# Altium schematic sheet UARC_Sensor.SchDoc
size A2; SheetNumber: 1; SheetTotal: 1
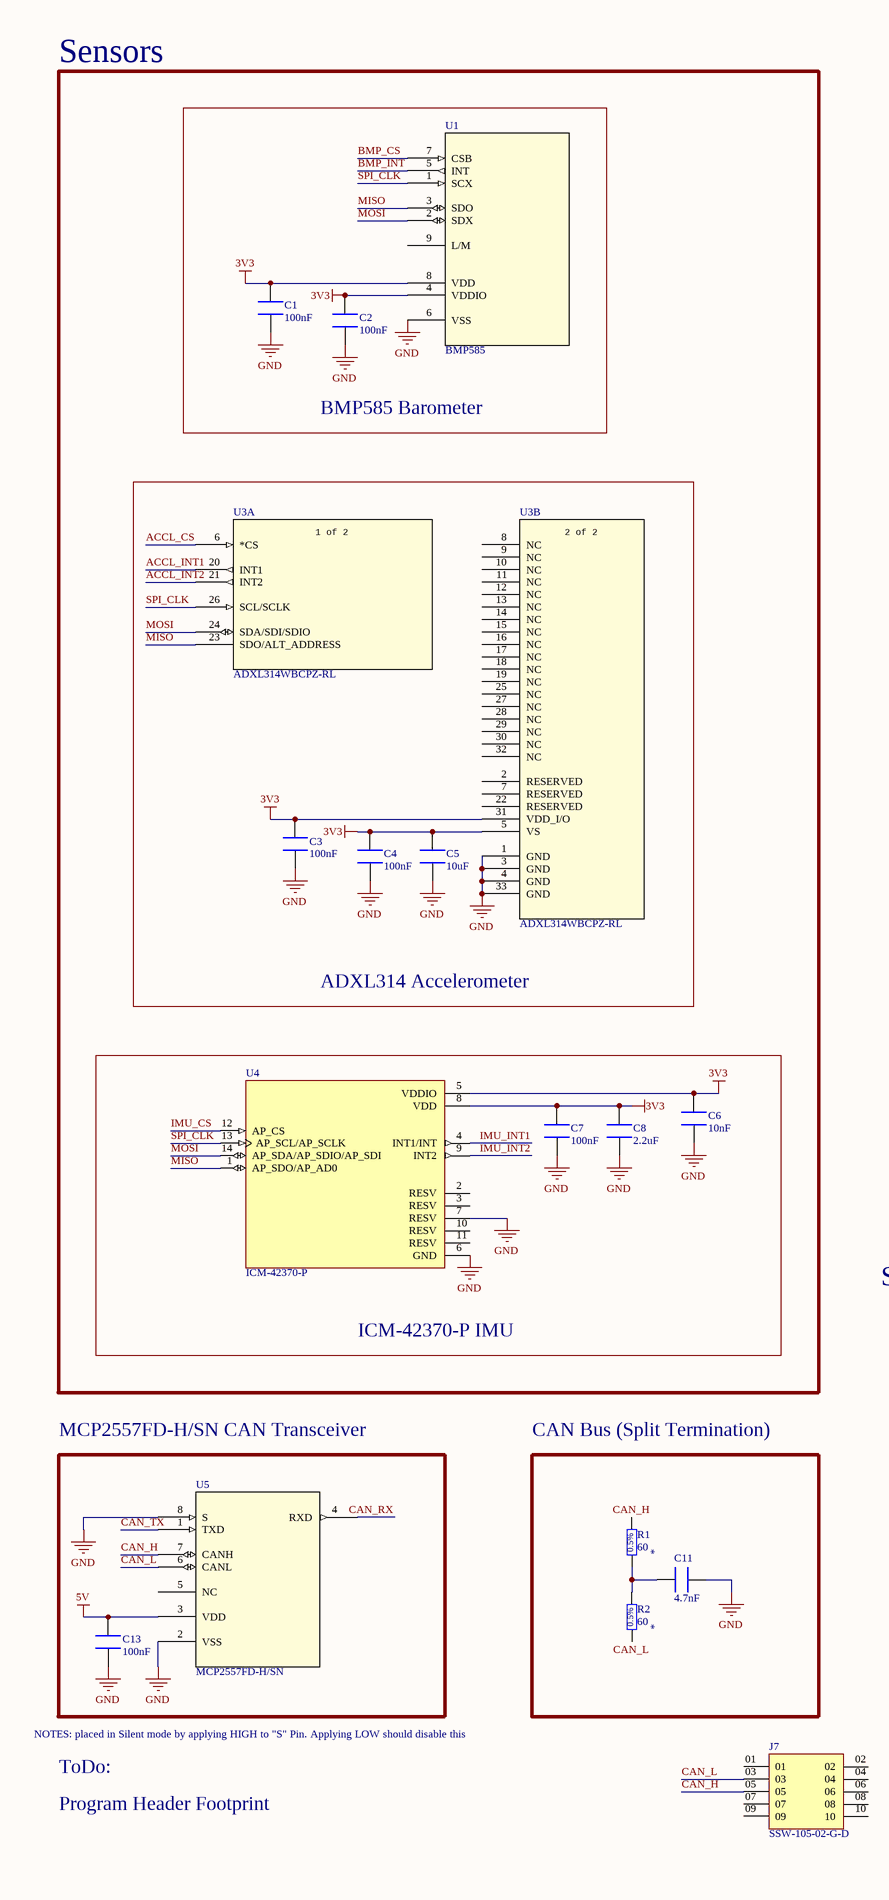
[diagram p0: UARC_Sensor.SchDoc, left]
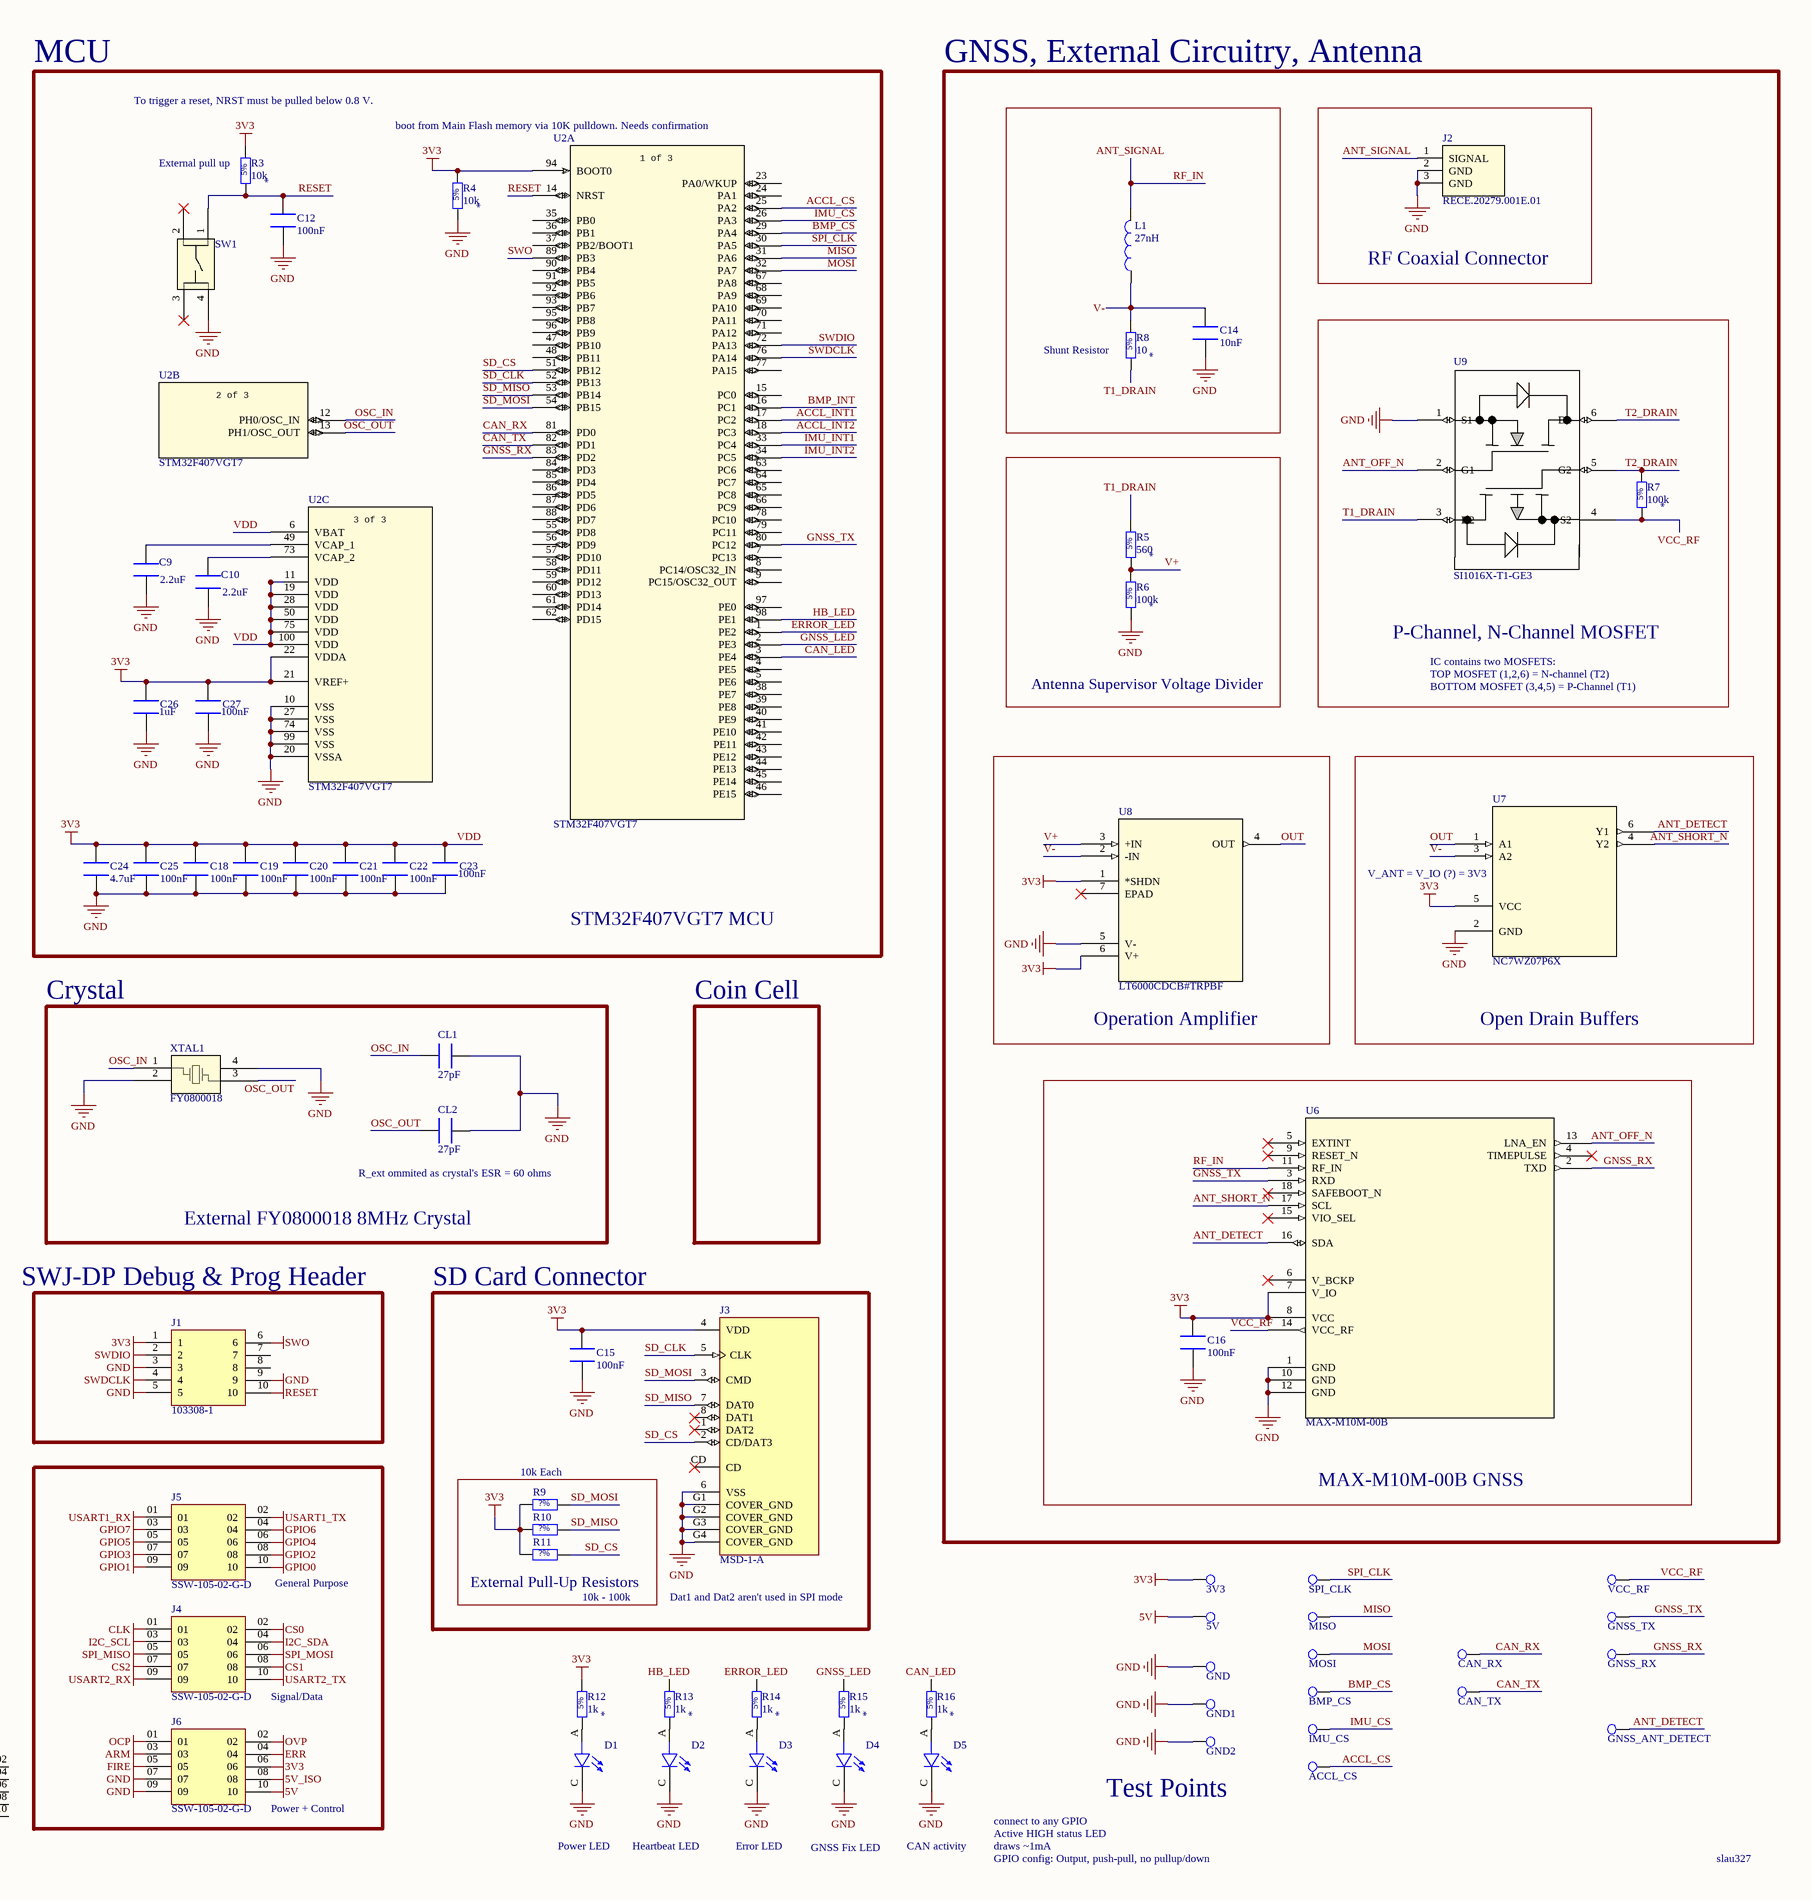
[diagram p1: UARC_Sensor.SchDoc, right]

## Parts
3V3  Test Point  [Test Point Pad Large]  (value not drawn)  (no BOM)
5V  Test Point  [Test Point Pad Large]  (value not drawn)  (no BOM)
ACCL_CS  Test Point  [Test Point Pad Large]  (value not drawn)  (no BOM)
BMP_CS  Test Point  [Test Point Pad Large]  (value not drawn)  (no BOM)
C1  100nF  [CAPACITOR_0805_2012M-70N]
C2  100nF  [CAPACITOR_0805_2012M-70N]
C3  100nF  [CAPACITOR_0805_2012M-70N]
C4  100nF  [CAPACITOR_0805_2012M-70N]
C5  10uF  [CAPACITOR_0805_2012M-70N]
C6  10nF  [CAPACITOR_0805_2012M-70N]
C7  100nF  [CAPACITOR_0805_2012M-70N]
C8  2.2uF  [CAPACITOR_0805_2012M-70N]
C9  2.2uF  [CAPACITOR_0805_2012M-70N]
C10  2.2uF  [CAPACITOR_0805_2012M-70N]
C11  4.7nF  [CAPACITOR_0805_2012M-70N]
C12  100nF  [CAPACITOR_0805_2012M-70N]
C13  100nF  [CAPACITOR_0805_2012M-70N]
C14  10nF  [CAPACITOR_0402_1005M_55N]
C15  100nF  [CAPACITOR_0805_2012M-70N]
C16  100nF  [CAPACITOR_0805_2012M-70N]
C18  100nF  [CAPACITOR_0805_2012M-70N]
C19  100nF  [CAPACITOR_0805_2012M-70N]
C20  100nF  [CAPACITOR_0805_2012M-70N]
C21  100nF  [CAPACITOR_0805_2012M-70N]
C22  100nF  [CAPACITOR_0805_2012M-70N]
C23  100nF  [CAPACITOR_0805_2012M-70N]
C24  4.7uF  [CAPACITOR_0603_1608M_100N]
C25  100nF  [CAPACITOR_0805_2012M-70N]
C26  1uF  [CAPACITOR_0805_2012M-70N]
C27  100nF  [CAPACITOR_0805_2012M-70N]
CAN_RX  Test Point  [Test Point Pad Large]  (value not drawn)  (no BOM)
CAN_TX  Test Point  [Test Point Pad Large]  (value not drawn)  (no BOM)
CL1  27pF  [CAPACITOR_0805_2012M-70N]
CL2  27pF  [CAPACITOR_0805_2012M-70N]
D1  SML-D12U1WT86  [LED_SML-D12U1WT86]  (value not drawn)
D2  SML-D12U1WT86  [LED_SML-D12U1WT86]  (value not drawn)
D3  SML-D12U1WT86  [LED_SML-D12U1WT86]  (value not drawn)
D4  SML-D12U1WT86  [LED_SML-D12U1WT86]  (value not drawn)
D5  SML-D12U1WT86  [LED_SML-D12U1WT86]  (value not drawn)
GND  Test Point  [Test Point Pad Large]  (value not drawn)  (no BOM)
GND1  Test Point  [Test Point Pad Large]  (value not drawn)  (no BOM)
GND2  Test Point  [Test Point Pad Large]  (value not drawn)  (no BOM)
GNSS_ANT_DETECT  Test Point  [Test Point Pad Large]  (value not drawn)  (no BOM)
GNSS_RX  Test Point  [Test Point Pad Large]  (value not drawn)  (no BOM)
GNSS_TX  Test Point  [Test Point Pad Large]  (value not drawn)  (no BOM)
IMU_CS  Test Point  [Test Point Pad Large]  (value not drawn)  (no BOM)
J1  103308-1  [TE_103308-1]
J2  RECE.20279.001E.01  [CON3_RECE.20279.001E.01_TAL]
J3  MSD-1-A  [CUI_MSD-1-A]
J4  SSW-105-02-G-D  [SAMTEC_SSW-105-02-G-D]
J5  SSW-105-02-G-D  [SAMTEC_SSW-105-02-G-D]
J6  SSW-105-02-G-D  [SAMTEC_SSW-105-02-G-D]
J7  SSW-105-02-G-D  [SAMTEC_SSW-105-02-G-D]
L1  27nH  [INDC1005X55N]
MISO  Test Point  [Test Point Pad Large]  (value not drawn)  (no BOM)
MOSI  Test Point  [Test Point Pad Large]  (value not drawn)  (no BOM)
R1  60  [RESISTOR_1206_3216M_55N]
R2  60  [RESISTOR_1206_3216M_55N]
R3  10k  [Resistor_0805_2012M-50N]
R4  10k  [Resistor_0805_2012M-50N]
R5  560  [RESISTOR_0402_1005M_37N]
R6  100k  [RESISTOR_0402_1005M_37N]
R7  100k  [RESISTOR_0402_1005M_37N]
R8  10  [RESISTOR_0402_1005M_37N]
R9  (no value)  [RESISTOR_0805_2012M-50N]
R10  (no value)  [RESISTOR_0805_2012M-50N]
R11  (no value)  [RESISTOR_0805_2012M-50N]
R12  1k  [Resistor_0805_2012M-50N]
R13  1k  [Resistor_0805_2012M-50N]
R14  1k  [Resistor_0805_2012M-50N]
R15  1k  [Resistor_0805_2012M-50N]
R16  1k  [Resistor_0805_2012M-50N]
SPI_CLK  Test Point  [Test Point Pad Large]  (value not drawn)  (no BOM)
SW1  PTS526 SM15 SMTR2 LFS  [SON4_PTS526 SM15 SMTR2 LFS_CNK]  (value not drawn)
U1  BMP585  [LGA9_BMP585_BOS]
U2  STM32F407VGT7  [LQFP100-14x14mm]  (parts A,B,C of 3)
U3  ADXL314WBCPZ-RL  [LFCSP32_CP-32-17_ADI]  (parts A,B of 2)
U4  ICM-42370-P  [PQFN50P250X300X81-14N]
U5  MCP2557FD-H/SN  [SOIC8_SN_MCH]
U6  MAX-M10M-00B  [MOD18_MAX-M10M_UBL]
U7  NC7WZ07P6X  [SC-88SC70-6SOT-363_419B-02_ONS]
U8  LT6000CDCB#TRPBF  [DFN-6_DCB_LIT]
U9  SI1016X-T1-GE3  [SOT_X-T1-GE3_VIS]
VCC_RF  Test Point  [Test Point Pad Large]  (value not drawn)  (no BOM)
XTAL1  FY0800018  [4xtal- 1-3xtal 2-4NC_DIO]

## Blocks framed on the sheet
MCU: C9 C10 C12 C18-C27 R3 R4 SW1 U2
BMP585 Barometer: C1 C2 U1
Shunt Resistor: C14 L1 R8
RF Coaxial Connector: J2
P-Channel, N-Channel MOSFET: R7 U9
Antenna Supervisor Voltage Divider: R5 R6
ADXL314 Accelerometer: C3-C5 U3
Operation Amplifier: U8
Open Drain Buffers: U7
Crystal: CL1 CL2 XTAL1
ICM-42370-P IMU: C6-C8 U4
MAX-M10M-00B GNSS: C16 U6
SD Card Connector: C15 J3
MCP2557FD-H/SN CAN Transceiver: C13 U5
CAN Bus (Split Termination): C11 R1 R2
External Pull-Up Resistors: R9-R11

## Nets
5V: 5V.1 C13.2 J6.10 U5.3(VDD)
5V_ISO: J6.08
ARM: J6.03
CLK: J4.01
CS0: J4.02
CS1: J4.08
CS2: J4.07
ERR: J6.04
FIRE: J6.05
GND: C1.1 C2.2 C3.2 C4.2 C5.2 C6.2 C7.2 C8.2 C9.2 C10.2 C11.2 C12.2 C13.1 C14.1 C15.1 C16.1 C18.2 C19.2 C20.2 C21.2 C22.2 C23.2 C24.1 C25.2 C26.2 C27.2 CL1.2 CL2.2 D1.C D2.C D3.C D4.C D5.C GND.1 GND1.1 GND2.1 J1.3 J1.5 J1.9 J2.2(GND) J2.3(GND) J3.6(VSS) J3.G1(COVER_GND) J3.G2(COVER_GND) J3.G3(COVER_GND) J3.G4(COVER_GND) J6.07 J6.09 R4.1 R6.1 SW1.4 U1.6(VSS) U2.10(VSS) U2.20(VSSA) U2.27(VSS) U2.74(VSS) U2.99(VSS) U3.1(GND) U3.3(GND) U3.4(GND) U3.33(GND) U4.6(GND) U4.7(RESV) U5.2(VSS) U5.8(S) U6.1(GND) U6.10(GND) U6.12(GND) U7.2(GND) U8.5(V-) U9.1(S1) XTAL1.2 XTAL1.4
GPIO0: J5.10
GPIO1: J5.09
GPIO2: J5.08
GPIO3: J5.07
GPIO4: J5.06
GPIO5: J5.05
GPIO6: J5.04
GPIO7: J5.03
I2C_SCL: J4.03
I2C_SDA: J4.04
OCP: J6.01
OVP: J6.02
RESET: C12.1 J1.10 R3.1 SW1.1 U2.14(NRST)
SPI_MISO: J4.05
SPI_MOSI: J4.06
SWDCLK: J1.4 U2.76(PA14)
SWDIO: J1.2 U2.72(PA13)
SWO: J1.6 U2.89(PB3)
USART1_RX: J5.01
USART1_TX: J5.02
USART2_RX: J4.09
USART2_TX: J4.10
VDD: 3V3.1 C1.2 C2.1 C3.1 C4.1 C5.1 C6.1 C7.1 C8.1 C15.2 C16.2 C18.1 C19.1 C20.1 C21.1 C22.1 C23.1 C24.2 C25.1 C26.1 C27.1 J1.1 J3.4(VDD) J6.06 R3.2 R4.2 R9.1 R10.1 R11.1 R12.2 U1.4(VDDIO) U1.8(VDD) U2.6(VBAT) U2.11(VDD) U2.19(VDD) U2.21(VREF+) U2.22(VDDA) U2.28(VDD) U2.50(VDD) U2.75(VDD) U2.94(BOOT0) U2.100(VDD) U3.5(VS) U3.31(VDD_I/O) U4.5(VDDIO) U4.8(VDD) U6.7(V_IO) U6.8(VCC) U7.5(VCC) U8.1(*SHDN) U8.6(V+)  [also labelled 3V3]
ACCL_CS: ACCL_CS.1 U2.25(PA2) U3.6(*CS)
ACCL_INT1: U2.17(PC2) U3.20(INT1)
ACCL_INT2: U2.18(PC3) U3.21(INT2)
ANT_DETECT: GNSS_ANT_DETECT.1 U6.16(SDA) U7.6(Y1)
ANT_OFF_N: U6.13(LNA_EN) U9.2(G1)
ANT_SHORT_N: U6.17(SCL) U7.4(Y2)
ANT_SIGNAL: J2.1(SIGNAL) L1.2 U6.11(RF_IN)  [also labelled RF_IN]
BMP_CS: BMP_CS.1 U1.7(CSB) U2.29(PA4)
BMP_INT: U1.5(INT) U2.16(PC1)
CAN_H: J7.05 R1.2 U5.7(CANH)
CAN_L: J7.03 R2.1 U5.6(CANL)
CAN_LED: R16.2 U2.3(PE4)
CAN_RX: CAN_RX.1 U2.81(PD0) U5.4(RXD)
CAN_TX: CAN_TX.1 U2.82(PD1) U5.1(TXD)
ERROR_LED: R14.2 U2.1(PE2)
GNSS_LED: R15.2 U2.2(PE3)
GNSS_RX: GNSS_RX.1 U2.83(PD2) U6.2(TXD)
GNSS_TX: GNSS_TX.1 U2.80(PC12) U6.3(RXD)
HB_LED: R13.2 U2.98(PE1)
IMU_CS: IMU_CS.1 U2.26(PA3) U4.12(AP_CS)
IMU_INT1: U2.33(PC4) U4.4(INT1/INT)
IMU_INT2: U2.34(PC5) U4.9(INT2)
MISO: MISO.1 U1.3(SDO) U2.31(PA6) U3.23(SDO/ALT_ADDRESS) U4.1(AP_SDO/AP_AD0)
MOSI: MOSI.1 U1.2(SDX) U2.32(PA7) U3.24(SDA/SDI/SDIO) U4.14(AP_SDA/AP_SDIO/AP_SDI)
OSC_IN: CL1.1 U2.12(PH0/OSC_IN) XTAL1.1
OSC_OUT: CL2.1 U2.13(PH1/OSC_OUT) XTAL1.3
OUT: U7.1(A1) U8.4(OUT)
SD_CLK: J3.5(CLK) U2.52(PB13)
SD_CS: J3.2(CD/DAT3) R11.2 U2.51(PB12)
SD_MISO: J3.7(DAT0) R10.2 U2.53(PB14)
SD_MOSI: J3.3(CMD) R9.2 U2.54(PB15)
SPI_CLK: SPI_CLK.1 U1.1(SCX) U2.30(PA5) U3.26(SCL/SCLK) U4.13(AP_SCL/AP_SCLK)
T1_DRAIN: R5.2 R8.1 U9.3(D2)
T2_DRAIN: R7.2 U9.5(G2) U9.6(D1)
V+: R5.1 R6.2 U8.3(+IN)
V-: C14.2 L1.1 R8.2 U7.3(A2) U8.2(-IN)
VCC_RF: R7.1 U6.14(VCC_RF) U9.4(S2) VCC_RF.1
NetC9_1: C9.1 U2.49(VCAP_1)
NetC10_1: C10.1 U2.73(VCAP_2)
NetC11_1: C11.1 R1.1 R2.2
NetD1_A: D1.A R12.1
NetD2_A: D2.A R13.1
NetD3_A: D3.A R14.1
NetD4_A: D4.A R15.1
NetD5_A: D5.A R16.1

Not connected (* = marked no-connect by the designer): J1 7 8; J3 1(DAT2)* 8(DAT1)* CD*; J7 01 02 04 06 07 08 09 10; SW1 2* 3*; U1 9(L/M); U2 4(PE5) 5(PE6) 7(PC13) 8(PC14/OSC32_IN) 9(PC15/OSC32_OUT) 15(PC0) 23(PA0/WKUP) 24(PA1) 35(PB0) 36(PB1) 37(PB2/BOOT1) 38(PE7) 39(PE8) 40(PE9) 41(PE10) 42(PE11) 43(PE12) 44(PE13) 45(PE14) 46(PE15) 47(PB10) 48(PB11) 55(PD8) 56(PD9) 57(PD10) 58(PD11) 59(PD12) 60(PD13) 61(PD14) 62(PD15) 63(PC6) 64(PC7) 65(PC8) 66(PC9) 67(PA8) 68(PA9) 69(PA10) 70(PA11) 71(PA12) 77(PA15) 78(PC10) 79(PC11) 84(PD3) 85(PD4) 86(PD5) 87(PD6) 88(PD7) 90(PB4) 91(PB5) 92(PB6) 93(PB7) 95(PB8) 96(PB9) 97(PE0); U3 2(RESERVED) 7(RESERVED) 8(NC) 9(NC) 10(NC) 11(NC) 12(NC) 13(NC) 14(NC) 15(NC) 16(NC) 17(NC) 18(NC) 19(NC) 22(RESERVED) 25(NC) 27(NC) 28(NC) 29(NC) 30(NC) 32(NC); U4 2(RESV) 3(RESV) 10(RESV) 11(RESV); U5 5(NC); U6 4(TIMEPULSE)* 5(EXTINT)* 6(V_BCKP)* 9(RESET_N)* 15(VIO_SEL)* 18(SAFEBOOT_N)*; U8 7(EPAD)*

## Notes on the sheet
- Sensors
- To trigger a reset, NRST must be pulled below 0.8 V.
- GNSS, External Circuitry, Antenna
- (near R3) External pull up
- boot from Main Flash memory via 10K pulldown. Needs confirmation
- IC contains two MOSFETS:
- TOP MOSFET (1,2,6) = N-channel (T2)
- BOTTOM MOSFET (3,4,5) = P-Channel (T1)
- STM32F407VGT7 MCU
- (near U7) V_ANT = V_IO (?) = 3V3
- Coin Cell
- (near CL2) R_ext ommited as crystal's ESR = 60 ohms
- External FY0800018 8MHz Crystal
- SWJ-DP Debug & Prog Header
- (near R9) 10k Each
- General Purpose
- 10k - 100k
- Dat1 and Dat2 aren't used in SPI mode
- NOTES: placed in Silent mode by applying HIGH to "S" Pin. Applying LOW should disable this
- Signal/Data
- ToDo:
- (near GND2) Test Points
- Program Header Footprint
- (near J6) Power + Control
- Power LED
- Heartbeat LED
- Error LED
- GNSS Fix LED
- CAN activity
- Active HIGH status LED
- draws ~1mA
- connect to any GPIO
- GPIO config: Output, push-pull, no pullup/down
- slau327
- (in symbol ADXL314WBCPZ-RL, part A) 1 of 2
- (in symbol ADXL314WBCPZ-RL, part B) 2 of 2
- (in symbol STM32F407VGT7, part A) 1 of 3
- (in symbol STM32F407VGT7, part B) 2 of 3
- (in symbol STM32F407VGT7, part C) 3 of 3

## Library data of the parts
C1-C4 C7 C12 C15 C16 C18-C23 C25 C27 = GRM21BR61E226ME44L: CUSTOM: 885012207016 0.1µF 0805 ±10% 10V X7R Ceramic Capacitor; APSS Standard Part: APSS Standard; Tolerance: ±20%; Temperature Coefficient: X5R; Rated Voltage: 25V; Temp Range: -55°C ~ 85°C; Capacitance at Rated Voltage: 10%; Package: 0805; Supplier 1: Digikey; Supplier 1 Part No.: 490-GRM155R61J224KE01JCT-ND; MF Part No.: GRM21BR61E226ME44L; Value: 100nF
C5 = GRM21BR61E226ME44L: CUSTOM: TACR106K010XTA 10µF 0805 ±10% 10V Tantalum Capacitor; APSS Standard Part: APSS Standard; Tolerance: ±20%; Temperature Coefficient: X5R; Rated Voltage: 25V; Temp Range: -55°C ~ 85°C; Capacitance at Rated Voltage: 10%; Package: 0805; Supplier 1: Digikey; Supplier 1 Part No.: 490-GRM155R61J224KE01JCT-ND; MF Part No.: GRM21BR61E226ME44L; Value: 10uF
C6 = GRM21BR61E226ME44L: CUSTOM: 885012207011, 10000pF 0805 ±10% 10 X7R  Ceramic Capacitor; APSS Standard Part: APSS Standard; Tolerance: ±20%; Temperature Coefficient: X5R; Rated Voltage: 25V; Temp Range: -55°C ~ 85°C; Capacitance at Rated Voltage: 10%; Package: 0805; Supplier 1: Digikey; Supplier 1 Part No.: 490-GRM155R61J224KE01JCT-ND; MF Part No.: GRM21BR61E226ME44L; Value: 10nF
C8-C10 = GRM21BR61E226ME44L: CUSTOM: GRM21BR71A225KA01L 2.2µF 0805 ±10% 10V X7R Ceramic Capacitor; APSS Standard Part: APSS Standard; Tolerance: ±20%; Temperature Coefficient: X5R; Rated Voltage: 25V; Temp Range: -55°C ~ 85°C; Capacitance at Rated Voltage: 10%; Package: 0805; Supplier 1: Digikey; Supplier 1 Part No.: 490-GRM155R61J224KE01JCT-ND; MF Part No.: GRM21BR61E226ME44L; Value: 2.2uF
C11 = GRM21BR61E226ME44L: CUSTOM: CC0805KRX7R9BB472 4700pF 0805 ±10% 50V X7R Ceramic Capacitor; APSS Standard Part: APSS Standard; Tolerance: ±20%; Temperature Coefficient: X5R; Rated Voltage: 25V; Temp Range: -55°C ~ 85°C; Capacitance at Rated Voltage: 10%; Package: 0805; Supplier 1: Digikey; Supplier 1 Part No.: 490-GRM155R61J224KE01JCT-ND; MF Part No.: GRM21BR61E226ME44L; Value: 4.7nF
C13 = GRM21BR60J107ME15L: CUSTOM: 885012207016 0.1µF 0805 ±10% 10V X7R Ceramic Capacitor; APSS Standard Part: APSS Standard; Tolerance: ±20%; Temperature Coefficient: X5R; Capacitance at Rated Voltage: 20%; Rated Voltage: 6.3V; Temp Range: -55°C ~ 85°C; Package: 0805; Supplier 1: Digikey; Supplier 1 Part No.: 490-GRM155R61E225KE11JCT-ND; MF Part No.: GRM21BR60J107ME15L; Value: 100nF
C14 = GRM155R61E225KE11J: CUSTOM: GRM155R71C103KA01D, 10000pF 0402 ±10% 16V X7R Ceramic Capacitor; APSS Standard Part: APSS Standard; Temperature Coefficient: X5R; Rated Voltage: 25V; Temp Range: -55°C ~ 85°C; Tolerance: ±10%; Capacitance at Rated Voltage: 10%; Package: 0402; Supplier 1: Digikey; Supplier 1 Part No.: 490-10749-1-ND; MF Part No.: GRM155R61E225KE11J; Value: 10nF
C24 = GRM188Z71A106KA73D: CUSTOM:  GRM188Z71A475KE15D 4.7µF 0603 ±10% 10V X7R Ceramic Capacitor; APSS Standard Part: APSS Standard; Capacitance at Rated Voltage: 20%; Temp Range: -55°C ~ 125°C; Tolerance: ±10%; Temperature Coefficient: X7R; Rated Voltage: 10V; Package: 0603; Supplier 1: Digikey; Supplier 1 Part No.: 490-5313-1-ND; MF Part No.: GRM188Z71A106KA73D; Value: 4.7uF
C26 = GRM21BR61E226ME44L: CUSTOM: 0805ZC105KAT2A 1µF 0805 ±10% 10V X7R  Ceramic Capacitor; APSS Standard Part: APSS Standard; Tolerance: ±20%; Temperature Coefficient: X5R; Rated Voltage: 25V; Temp Range: -55°C ~ 85°C; Capacitance at Rated Voltage: 10%; Package: 0805; Supplier 1: Digikey; Supplier 1 Part No.: 490-GRM155R61J224KE01JCT-ND; MF Part No.: GRM21BR61E226ME44L; Value: 1uF
CL1 CL2 = GRM21BR61E226ME44L: CUSTOM: 600F270JT250XT4K 27pF 0805 ±5% 250V C0G, NP0 Ceramic Capacitor; APSS Standard Part: APSS Standard; Tolerance: ±20%; Temperature Coefficient: X5R; Capacitance at Rated Voltage: 10%; Rated Voltage: 25V; Temp Range: -55°C ~ 85°C; Package: 0805; Supplier 1: Digikey; Supplier 1 Part No.: 490-GRM155R61J224KE01JCT-ND; MF Part No.: GRM21BR61E226ME44L; Value: 27pF
D1-D5 = SML-D12U1WT86: Red 620nm LED Indication - Discrete 2.2V 0603 (1608 Metric); MF: Rohm; Package: 0603 Rohm; Price: None; Check_prices: https://www.snapeda.com/parts/SML-D12U1WT86/Rohm/view-part/?ref=eda; Value: *; SnapEDA_Link: https://www.snapeda.com/parts/SML-D12U1WT86/Rohm/view-part/?ref=snap; MP: SML-D12U1WT86; Availability: In Stock; Purchase-URL: https://pricing.snapeda.com/search?q=SML-D12U1WT86&ref=eda
J1 = 103308-1: Header;  Pin;  Vertical;  Copper Alloy;  Thermoplastic;  10;  0.100 x 0.100 in.;  1 A; MF: TE Connectivity; Package: None; MP: 103308-1; Value: *; Price: None; Availability: Unavailable; SnapEDA_Link: https://www.snapeda.com/parts/103308-1/TE%20Connectivity%20AMP%20Connectors/view-part/519501/?ref=snap
J2 = RECE.20279.001E.01: No Description Available; Manufacturer_Name: Taoglas Limited; Type: Coaxial Connectors(RF) Assemblies; Copyright: Copyright (C) 2025 Ultra Librarian. All rights reserved.; Manufacturer_Part_Number: RECE.20279.001E.01; Digi-Key_Part_Number_1: 931-1107-1-ND; Digi-Key_Part_Number_2: 931-1107-6-ND; Digi-Key_Part_Number_3: 931-1107-2-ND; RefDes: RefDes
J3 = MSD-1-A: Micro SD Card Connector, 9 Positions, Connector and Ejector, Push In, Auto Eject Out, Surface Mount, 1.8 mm Height Above Board, Gold Flash; MF: Same Sky; SnapEDA_Link: https://www.snapeda.com/parts/MSD-1-A/Same+Sky/view-part/?ref=snap; Package: None; Value: *; MP: MSD-1-A; Check_prices: https://www.snapeda.com/parts/MSD-1-A/Same+Sky/view-part/?ref=eda
J4-J7 = SSW-105-02-G-D: MF: Samtec Inc.; Package: None; Availability: Unavailable; Value: *; MP: SSW-105-02-G-D; Price: None
L1 = LQG15HH27NJ02D: LQG15HN2N2S02D 27nH 0402  Unshielded Multilayer Inductor 350 mA 460mOhm Max; Package: None; Price: None; Value: *; MP: LQG15HH27NJ02D; Availability: Unavailable
R1 R2 = TNPW1206xxxxDE Series: CUSTOM: CRCW120660R0KNEAIF 60 Ohms 1206  ±10% 0.25W, 1/4W Chip Resistor,; Tolerance: 0.5%; Power: 0.52W; E Series: E24+E96; Value Range: 1R ~ 2M; Temp Range: -55°C ~ 155°C; Rated Voltage: 200V; Temperature Coefficient: ±200ppm/°C; Supplier 1: Digikey; Package: 0805; MF Part No.: *; Value: 60
R3 R4 = RMCF0805JT Series: CUSTOM: CRCW080510K0FKEA 10 kOhms 0805  ±1% 0.25W, 1/4W Chip Resistor; APSS Standard Part: APSS Standard; Tolerance: 5%; Power: 1/8W; E Series: E24; Value Range: 100m ~ 22M; Temp Range: -55°C ~ 155°C; Rated Voltage: 150V; Temperature Coefficient: ±200ppm/°C; Supplier 1: Digikey; Package: 0805; MF Part No.: *; Value: 10k
R5 = RMCF0402JT Series: CUSTOM: ERJ-2GEJ561X 560 Ohms 0402  ±5% 0.1W, 1/10W Chip Resistor; APSS Standard Part: APSS Standard; Power: 1/16W; E Series: E24; Value Range: 1 ~ 20M; Temp Range: -55°C ~ 155°C; Rated Voltage: 50V; Temperature Coefficient: ±100ppm/°C; Tolerance: 5%; Supplier 1: Digikey; Package: 0402; MF Part No.: *; Value: 560
R6 R7 = RMCF0402JT Series: CUSTOM: RK73B1ETTP104J 100 kOhms 0402 ±5% 0.1W, 1/10W Chip Resistor; APSS Standard Part: APSS Standard; Power: 1/16W; E Series: E24; Value Range: 1 ~ 20M; Temp Range: -55°C ~ 155°C; Rated Voltage: 50V; Temperature Coefficient: ±100ppm/°C; Tolerance: 5%; Supplier 1: Digikey; Package: 0402; MF Part No.: *; Value: 100k
R8 = RMCF0402JT Series: CUSTOM: SG73P1EWTTP100J 10 Ohms 0402 ±5% 0.25W, 1/4W Chip Resistor; APSS Standard Part: APSS Standard; Power: 1/16W; E Series: E24; Value Range: 1 ~ 20M; Temp Range: -55°C ~ 155°C; Rated Voltage: 50V; Temperature Coefficient: ±100ppm/°C; Tolerance: 5%; Supplier 1: Digikey; Package: 0402; MF Part No.: *; Value: 10
R9-R11 = Generic Resistor: CUSTOM: CRCW080510K0FKEA 10 kOhms 0805  ±1% 0.25W, 1/4W Chip Resistor; Tolerance: ?%
R12-R16 = RMCF0805JT Series: CUSTOM: CRCW08051K00FKEA 1 kOhms 0805 ±1% 0.25W, 1/4W Chip Resistor; APSS Standard Part: APSS Standard; Tolerance: 5%; Power: 1/8W; E Series: E24; Value Range: 100m ~ 22M; Temp Range: -55°C ~ 155°C; Rated Voltage: 150V; Temperature Coefficient: ±200ppm/°C; Supplier 1: Digikey; Package: 0805; MF Part No.: *; Value: 1k
SW1 = PTS526 SM15 SMTR2 LFS: Description; Manufacturer_Name: C&K Components; Copyright: Copyright (C) 2025 Ultra Librarian. All rights reserved.; Manufacturer_Part_Number: PTS526 SM15 SMTR2 LFS; RefDes: RefDes; Type: Type
U1 = BMP585: No Description Available; Manufacturer_Name: Bosch Sensortec; Type: Pressure Sensors, Transducers; Copyright: Copyright (C) 2025 Ultra Librarian. All rights reserved.; Manufacturer_Part_Number: BMP585; Digi-Key_Part_Number_1: 828-BMP585TR-ND; Digi-Key_Part_Number_2: 828-BMP585CT-ND; Digi-Key_Part_Number_3: 828-BMP585DKR-ND; RefDes: RefDes
U2 = STM32F407VGT7: High-performance foundation line, Arm Cortex-M4 core with DSP and FPU, 1 Mbyte of Flash memory, 168 MHz CPU, ART Accelerator, Ethernet, FSMC; Manufacturer_Name: STMicroelectronics; Copyright: Copyright (C) 2025 Ultra Librarian. All rights reserved.; Manufacturer_Part_Number: STM32F407VGT7; RefDes: RefDes; Type: Type
U3 = ADXL314WBCPZ-RL: Â±200 g Range, 3-Axis Digital Accelerometer; Manufacturer_Name: Analog Devices Inc; Copyright: Copyright (C) 2025 Ultra Librarian. All rights reserved.; Manufacturer_Part_Number: ADXL314WBCPZ-RL; RefDes: RefDes; Type: Type
U4 = ICM-42370-P: Accelerometer X, Y, Z Axis 2g, 4g, 8g, 16g 14-LGA (2.5x3); MF: InvenSense; SnapEDA_Link: https://www.snapeda.com/parts/ICM-42370-P/InvenSense/view-part/?ref=snap; Package: None; Value: *; MP: ICM-42370-P; Check_prices: https://www.snapeda.com/parts/ICM-42370-P/InvenSense/view-part/?ref=eda
U5 = MCP2557FD-HSN: No Description Available; Manufacturer_Name: Microchip; Copyright: Copyright (C) 2025 Ultra Librarian. All rights reserved.; Manufacturer_Part_Number: MCP2557FD-H/SN; Digi-Key_Part_Number_1: MCP2557FD-H/SN-ND; RefDes: RefDes; Type: Type
U6 = MAX-M10M-00B: No Description Available; Manufacturer_Name: Ublox; Type: RF; Copyright: Copyright (C) 2025 Ultra Librarian. All rights reserved.; Manufacturer_Part_Number: MAX-M10M-00B; Digi-Key_Part_Number_1: 672-MAX-M10M-00BTR-ND; Digi-Key_Part_Number_2: 672-MAX-M10M-00BCT-ND; Digi-Key_Part_Number_3: 672-MAX-M10M-00BDKR-ND; RefDes: RefDes
U7 = NC7WZ07P6X: Description; Manufacturer_Name: onsemi; Copyright: Copyright (C) 2025 Ultra Librarian. All rights reserved.; Manufacturer_Part_Number: NC7WZ07P6X; RefDes: RefDes; Type: Type
U8 = LT6000CDCBTRPBF: Single 1.8V, 13ÂµA Precision Rail-to-Rail Op Amp; Manufacturer_Name: Analog Devices Inc; Copyright: Copyright (C) 2025 Ultra Librarian. All rights reserved.; Manufacturer_Part_Number: LT6000CDCB#TRPBF; Datasheet: https://www.analog.com/media/en/technical-documentation/data-sheets/600012fa.pdf; Digi-Key_Part_Number_1: 505-LT6000CDCB#TRPBFCT-ND; Digi-Key_Part_Number_2: 505-LT6000CDCB#TRPBFDKR-ND; Digi-Key_Part_Number_3: 505-LT6000CDCB#TRPBFTR-ND; Digi-Key_Part_Number_4: LT6000CDCB#TRPBF-ND; RefDes: RefDes; Type: Type
U9 = SI1016X-T1-GE3: COMPLEMENTARY N & P-CH 20-V (D-S) MOSFET; Manufacturer_Name: Vishay; Copyright: Copyright (C) 2025 Ultra Librarian. All rights reserved.; Manufacturer_Part_Number: SI1016X-T1-GE3; Datasheet: https://www.vishay.com/doc?71168; Digi-Key_Part_Number_1: SI1016X-T1-GE3TR-ND; Digi-Key_Part_Number_2: SI1016X-T1-GE3CT-ND; Digi-Key_Part_Number_3: SI1016X-T1-GE3DKR-ND; RefDes: RefDes; Type: Type
XTAL1 = FY0800018: No Description Available; Manufacturer_Name: Diodes Inc; Copyright: Copyright (C) 2025 Ultra Librarian. All rights reserved.; Manufacturer_Part_Number: FY0800018; RefDes: RefDes; Type: Type